# Altium schematic sheet interface.SchDoc
size A4
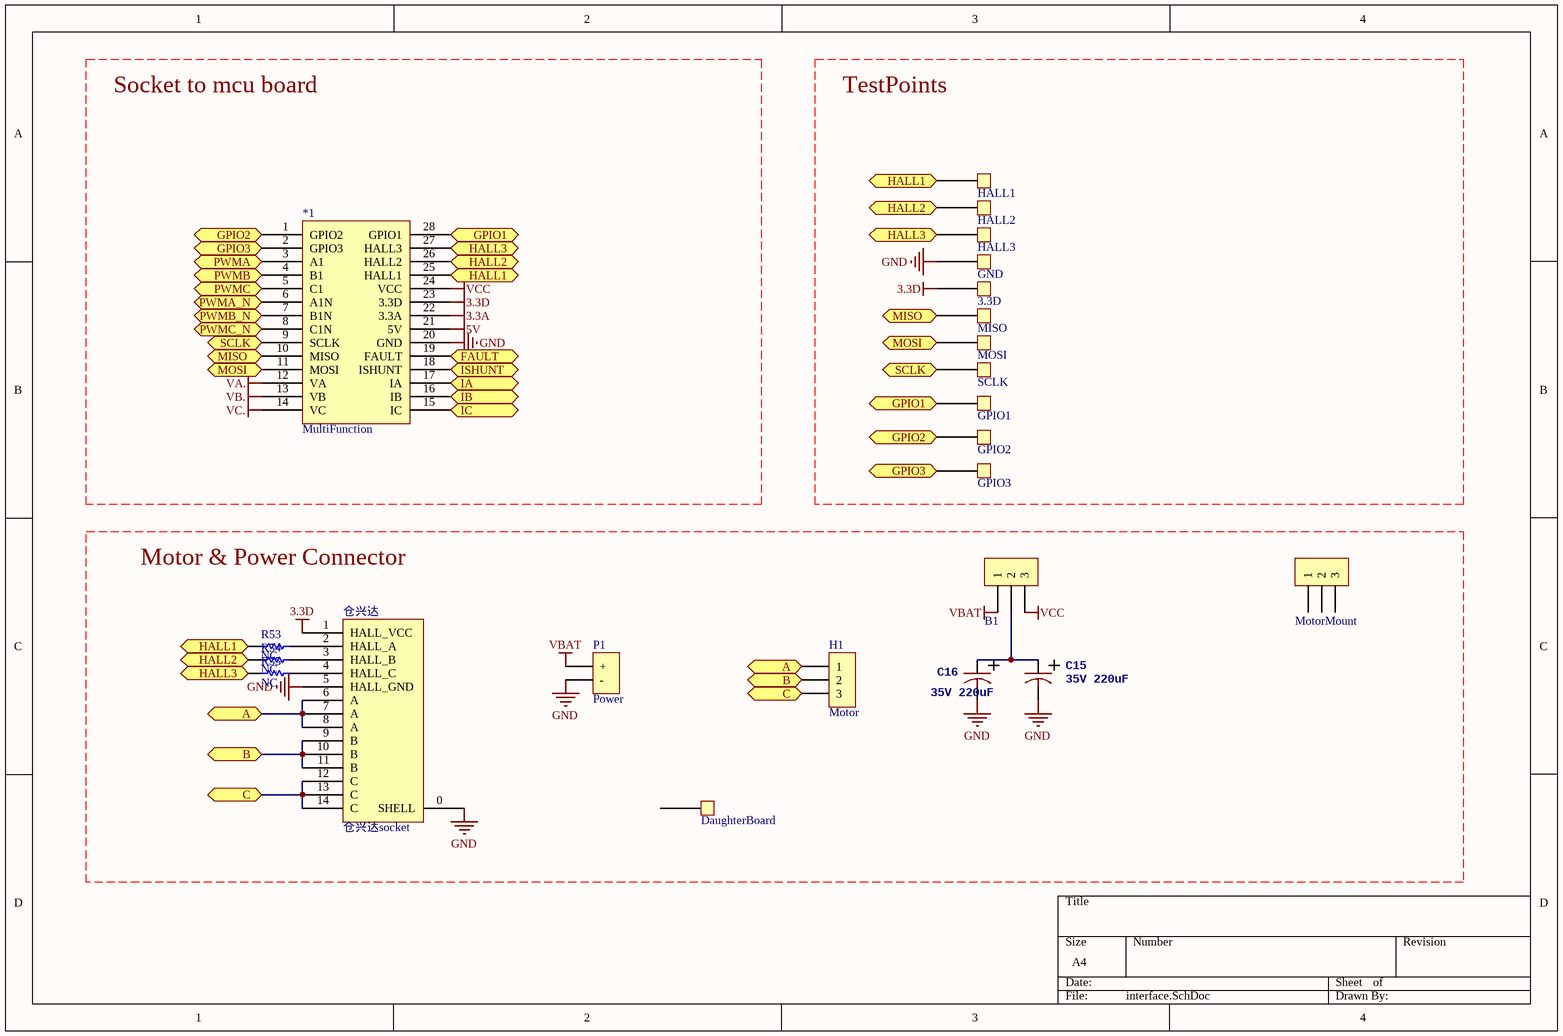
[diagram p0: interface.SchDoc]

## Parts
3.3D  TestPad  [TestPad]  (value not drawn)
*1  MultiFunction  [MultiFunction]
B1  RX  [SolderBridge60mil]  (value not drawn)
C15  35V 220uF  [HONOR_63X77]
C16  35V 220uF  [HONOR_63X77]
DaughterBoard  TestPad  [DaughterBoardHolder]  (value not drawn)
GND  TestPad  [TestPad]  (value not drawn)
GPIO1  TestPad  [TestPad]  (value not drawn)
GPIO2  TestPad  [TestPad]  (value not drawn)
GPIO3  TestPad  [TestPad]  (value not drawn)
H1  Motor  [MotorConnector2.5mm*3]
HALL1  TestPad  [TestPad]  (value not drawn)
HALL2  TestPad  [TestPad]  (value not drawn)
HALL3  TestPad  [TestPad]  (value not drawn)
MISO  TestPad  [TestPad]  (value not drawn)
MOSI  TestPad  [TestPad]  (value not drawn)
MotorMount  RX  [MotorMount]  (value not drawn)
P1  Power  [Power]
R53  NC  [0603]
R54  NC  [0603]
R55  NC  [0603]
SCLK  TestPad  [TestPad]  (value not drawn)
仓兴达  仓兴达socket  [FPC-0.5mm-14]

## Ports
A, B, C, FAULT, GPIO1, GPIO2, GPIO3, HALL1, HALL2, HALL3, IA, IB, IC, ISHUNT, MISO, MOSI, PWMA, PWMA_N, PWMB, PWMB_N, PWMC, PWMC_N, SCLK

## Nets
3.3A: *1.22(3.3A)
3.3D: 3.3D.1 *1.23(3.3D) 仓兴达.1(HALL_VCC)
5V: *1.21(5V)
GND: *1.20(GND) C15.2 C16.2 GND.1 P1.2(-) 仓兴达.0(SHELL) 仓兴达.5(HALL_GND)
VA.: *1.12(VA)
VB.: *1.13(VB)
VBAT: B1.1 P1.1(+)
VC.: *1.14(VC)
VCC: *1.24(VCC) B1.3
A: H1.1 仓兴达.6(A) 仓兴达.7(A) 仓兴达.8(A) ; port A
B: H1.2 仓兴达.9(B) 仓兴达.10(B) 仓兴达.11(B) ; port B
C: H1.3 仓兴达.12(C) 仓兴达.13(C) 仓兴达.14(C) ; port C
FAULT: *1.19(FAULT) ; port FAULT
GPIO1: *1.28(GPIO1) GPIO1.1 ; port GPIO1
GPIO2: *1.1(GPIO2) GPIO2.1 ; port GPIO2
GPIO3: *1.2(GPIO3) GPIO3.1 ; port GPIO3
HALL1: *1.25(HALL1) HALL1.1 R53.1 ; port HALL1
HALL2: *1.26(HALL2) HALL2.1 R54.1 ; port HALL2
HALL3: *1.27(HALL3) HALL3.1 R55.1 ; port HALL3
IA: *1.17(IA) ; port IA
IB: *1.16(IB) ; port IB
IC: *1.15(IC) ; port IC
ISHUNT: *1.18(ISHUNT) ; port ISHUNT
MISO: *1.10(MISO) MISO.1 ; port MISO
MOSI: *1.11(MOSI) MOSI.1 ; port MOSI
PWMA: *1.3(A1) ; port PWMA
PWMA_N: *1.6(A1N) ; port PWMA_N
PWMB: *1.4(B1) ; port PWMB
PWMB_N: *1.7(B1N) ; port PWMB_N
PWMC: *1.5(C1) ; port PWMC
PWMC_N: *1.8(C1N) ; port PWMC_N
SCLK: *1.9(SCLK) SCLK.1 ; port SCLK
NetB1_2: B1.2 C15.1 C16.1
NetR53_2: R53.2 仓兴达.2(HALL_A)
NetR54_2: R54.2 仓兴达.3(HALL_B)
NetR55_2: R55.2 仓兴达.4(HALL_C)

Not connected (* = marked no-connect by the designer): DaughterBoard 1(3); MotorMount 1 2 3

## Notes on the sheet
- Socket to mcu board
- TestPoints
- Motor & Power Connector

## Library data of the parts
B1 MotorMount = SolderBridge: Connector
C15 C16 = C-USC0402: 电容
H1 = CON3: Connector
P1 = PowerCon: Connector
R53-R55 = Res1: Resistor; Value: 10K; Published: 8-Jun-2000; LatestRevisionDate: 17-Jul-2002; LatestRevisionNote: Re-released for DXP Platform.; PackageReference: AXIAL-0.3; Publisher: Altium Limited; PackageDescription: Axial Device, Thru-Hole; 2 Leads; 0.3 in Pin Spacing